# Altium project EEE3061WDesignProject_LEDLightSensor.PrjPcb
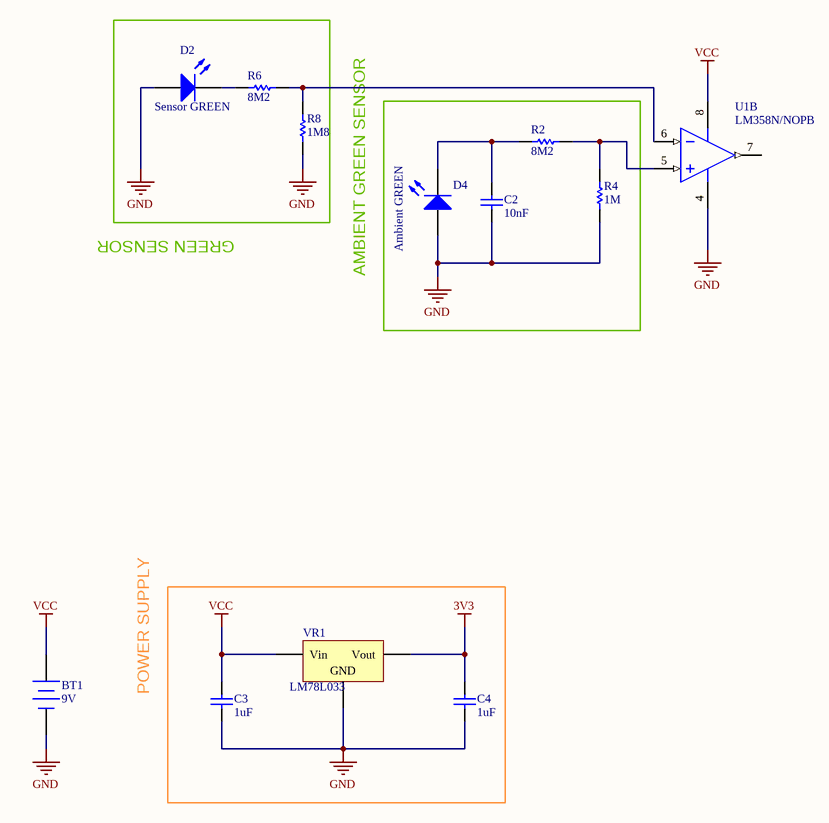
[diagram p0: LightSensorSchematic.SchDoc]
1 sheet, 12 parts. Net scope: global (net labels, ports and power ports of the same name join across sheets).

## Sheet LightSensorSchematic.SchDoc: EEE3061WDesignProject - Active Light Sensor
size A4; Revision: 4; SheetNumber: 1; SheetTotal: 1; PageSetup: Record=PageOptions|CenterHorizontal=True|CenterVertical=True|PrintScale=1.00|XCorrection=1.00|YCorrection=1.00|PrintKind=1|BorderSize=5000000|LeftOffset=0|BottomOffset=0|Orientation=2|PaperLength=2970|PaperWidth=2100|Scale=100|PaperSource=7|PrintQuality=600|MediaType=1|DitherType=10|PrintScaleMode=1|PaperKind=A4|PaperIndex=9

### Parts
BT1  9V  [BAT-2]
C2  10nF  [RAD-0.3]
C3  1uF  [RAD-0.3]
C4  1uF  [RAD-0.3]
D2  Sensor GREEN  [LED-0]
D4  Ambient GREEN  [LED-0]
R2  8M2  [AXIAL-0.3]
R4  1M  [AXIAL-0.3]
R6  8M2  [AXIAL-0.3]
R8  1M8  [AXIAL-0.3]
U1  LM358N/NOPB  [N08E]  (part B of 2)
VR1  LM78L033  [D2PAK_N]

### Nets
3V3: C4.2 VR1.3(Vout)
GND: BT1.2(-) C2.1 C3.1 C4.1 D2.1(A) D4.1(A) R4.1 R8.1 U1.4(GND) VR1.2(GND)
VCC: BT1.1(+) C3.2 U1.8(V+) VR1.1(Vin)
NetC2_2: C2.2 D4.2(K) R2.1
NetD2_2: D2.2(K) R6.1
NetR2_2: R2.2 R4.2 U1.5(INB+)
NetR6_2: R6.2 R8.2 U1.6(INB-)

Not connected (* = marked no-connect by the designer): U1 7(OUTB)

### Notes on the sheet
- GREEN SENSOR
- AMBIENT GREEN SENSOR
- POWER SUPPLY

### Library data of the parts
BT1 = Battery: Multicell Battery; Published: 24-Mar-1999; LatestRevisionDate: 17-Jul-2002; LatestRevisionNote: Re-released for DXP Platform.; PackageReference: BAT-2; Publisher: Altium Limited; PackageDescription: Battery; 2 Leads; Value: 9V
C2-C4 = Cap: Capacitor; Published: 8-Jun-2000; LatestRevisionDate: 17-Jul-2002; LatestRevisionNote: Re-released for DXP Platform.; PackageReference: RAD-0.3; Publisher: Altium Limited; PackageDescription: Radial Cap, Thru-Hole; 2 Leads; 0.3 in Pin Spacing
  C2: Value: 10nF
  C3 C4: Value: 1uF
D2 D4 = LED0: Typical INFRARED GaAs LED; Published: 8-Jun-2000; LatestRevisionDate: 08-Jul-2005; LatestRevisionNote: Mech Layer 1 removed.; PackageReference: LED-0; Publisher: Altium Limited; PackageDescription: LED; 2 Leads
R2 R4 R6 R8 = Res1: Resistor; Published: 8-Jun-2000; LatestRevisionDate: 17-Jul-2002; LatestRevisionNote: Re-released for DXP Platform.; PackageReference: AXIAL-0.3; Publisher: Altium Limited; PackageDescription: Axial Device, Thru-Hole; 2 Leads; 0.3 in Pin Spacing
  R2 R6: Value: 8M2
  R4: Value: 1M
  R8: Value: 1M8
U1 = CMP-0055-00153-1: Low Power Dual Operational Amplifier, 8-pin MDIP, Pb-Free; Manufacturer: National Semiconductor; PowerWise: N; PackageTopMarking: NSUZXYTTE#*LM*358N; CompType: Amplifiers; Code_JEDEC: MS-001-BA; DatasheetVersion: Oct-2005; RoHS: Y; PackageVersion: revG, May-2006; PackageReference: N08E; PackageDescription: MDIP, .365 x .250 x .130in, 8 Lead, .100in Pitch; PinCount: 8; PartId: 1
VR1 = Volt Reg: Voltage Regulator; Published: 24-Mar-1999; LatestRevisionDate: 29-May-2009; LatestRevisionNote: IPC-7351 Footprint Added.; PackageReference: D2PAK; Publisher: Altium Limited; PackageDescription: 3-Pin Transistor Outline Package 2.54 mm Pitch, 15.1 mm Lead Span